# Altium schematic sheet Keypad.SchDoc: Keypad
size 406 x 304 mm; Author: JFOSTER; Engineer: JFOSTER; Revision: A; SheetNumber: 1; SheetTotal: 1; Designer: JFOSTER
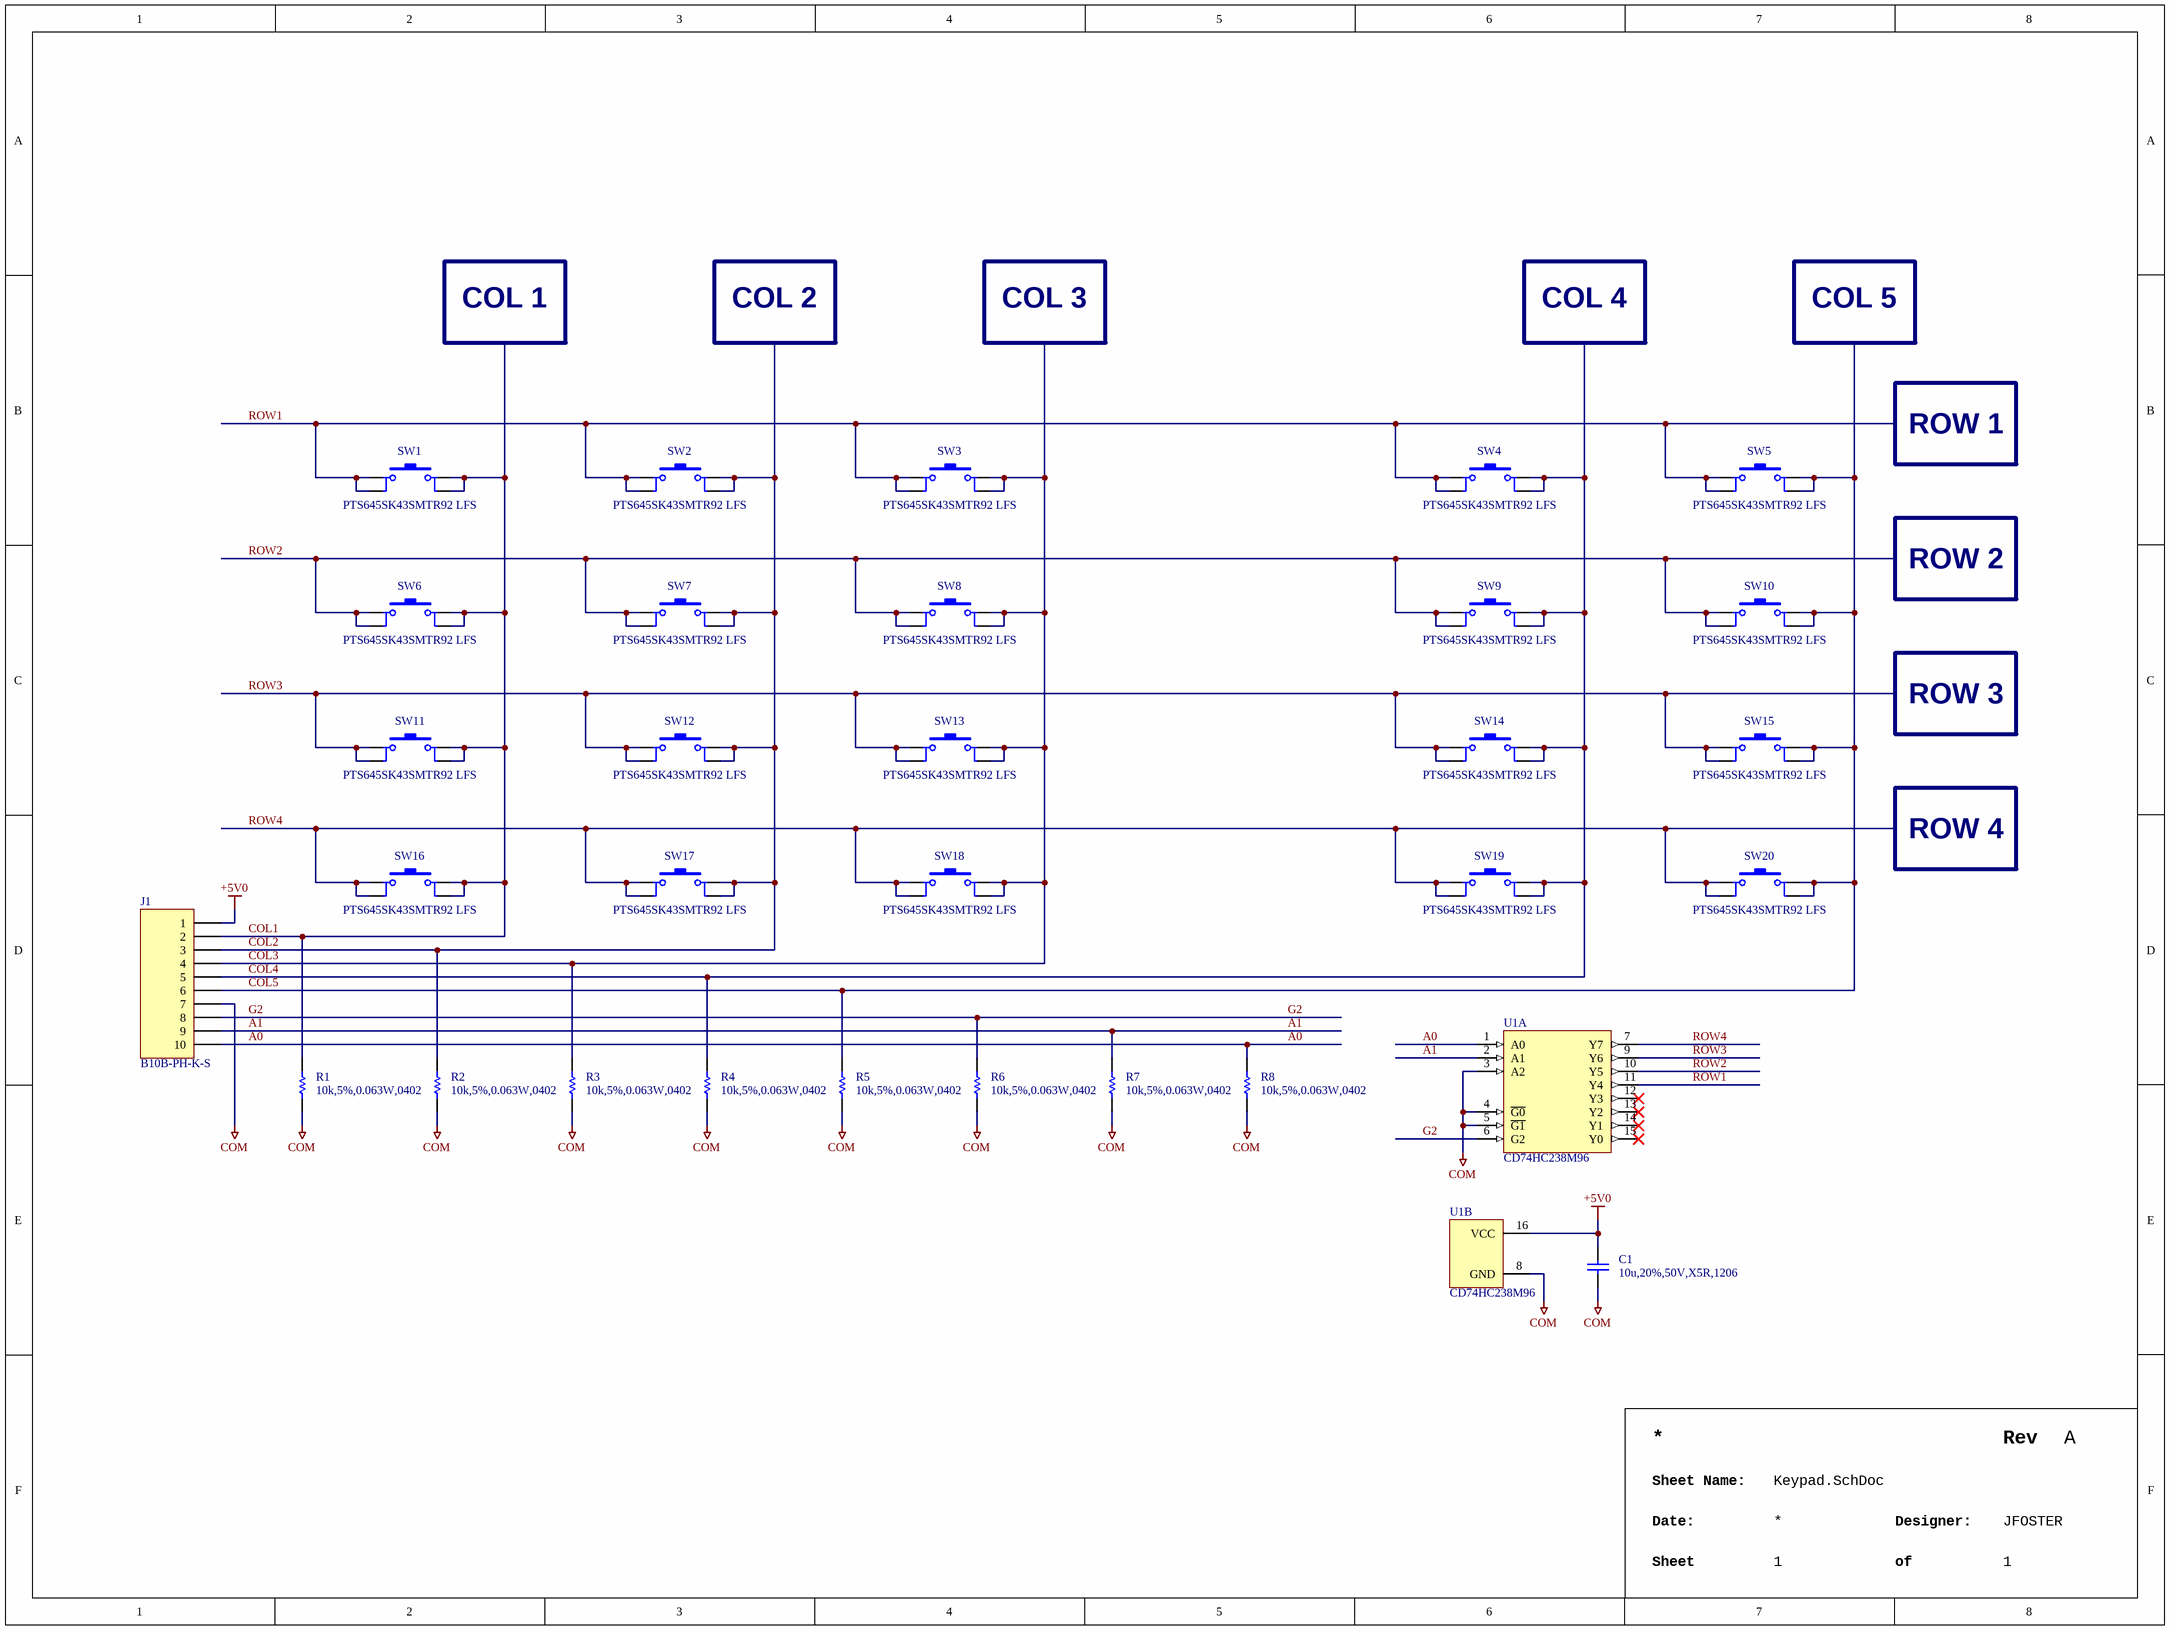
[diagram p0: Keypad.SchDoc]

## Parts
C1  10u,20%,50V,X5R,1206  [CAPC3216X16N]
J1  B10B-PH-K-S  [JST_B10B-PH-K-S]
R1  10k,5%,0.063W,0402  [RESC1005X04N]
R2  10k,5%,0.063W,0402  [RESC1005X04N]
R3  10k,5%,0.063W,0402  [RESC1005X04N]
R4  10k,5%,0.063W,0402  [RESC1005X04N]
R5  10k,5%,0.063W,0402  [RESC1005X04N]
R6  10k,5%,0.063W,0402  [RESC1005X04N]
R7  10k,5%,0.063W,0402  [RESC1005X04N]
R8  10k,5%,0.063W,0402  [RESC1005X04N]
SW1  PTS645SK43SMTR92 LFS  [C&K_PTS645SK43SMTR92 LFS]
SW2  PTS645SK43SMTR92 LFS  [C&K_PTS645SK43SMTR92 LFS]
SW3  PTS645SK43SMTR92 LFS  [C&K_PTS645SK43SMTR92 LFS]
SW4  PTS645SK43SMTR92 LFS  [C&K_PTS645SK43SMTR92 LFS]
SW5  PTS645SK43SMTR92 LFS  [C&K_PTS645SK43SMTR92 LFS]
SW6  PTS645SK43SMTR92 LFS  [C&K_PTS645SK43SMTR92 LFS]
SW7  PTS645SK43SMTR92 LFS  [C&K_PTS645SK43SMTR92 LFS]
SW8  PTS645SK43SMTR92 LFS  [C&K_PTS645SK43SMTR92 LFS]
SW9  PTS645SK43SMTR92 LFS  [C&K_PTS645SK43SMTR92 LFS]
SW10  PTS645SK43SMTR92 LFS  [C&K_PTS645SK43SMTR92 LFS]
SW11  PTS645SK43SMTR92 LFS  [C&K_PTS645SK43SMTR92 LFS]
SW12  PTS645SK43SMTR92 LFS  [C&K_PTS645SK43SMTR92 LFS]
SW13  PTS645SK43SMTR92 LFS  [C&K_PTS645SK43SMTR92 LFS]
SW14  PTS645SK43SMTR92 LFS  [C&K_PTS645SK43SMTR92 LFS]
SW15  PTS645SK43SMTR92 LFS  [C&K_PTS645SK43SMTR92 LFS]
SW16  PTS645SK43SMTR92 LFS  [C&K_PTS645SK43SMTR92 LFS]
SW17  PTS645SK43SMTR92 LFS  [C&K_PTS645SK43SMTR92 LFS]
SW18  PTS645SK43SMTR92 LFS  [C&K_PTS645SK43SMTR92 LFS]
SW19  PTS645SK43SMTR92 LFS  [C&K_PTS645SK43SMTR92 LFS]
SW20  PTS645SK43SMTR92 LFS  [C&K_PTS645SK43SMTR92 LFS]
U1  CD74HC238M96  [TEXASINSTRUMENTS_PKG_NS0016A]  (parts A,B of 2)

## Nets
+5V0: C1.2 J1.1 U1.16(VCC)
COM: C1.1 J1.7 R1.1 R2.1 R3.1 R4.1 R5.1 R6.1 R7.1 R8.1 U1.3(A2) U1.4(~{G0}) U1.5(~{G1}) U1.8(GND)
A0: J1.10 R8.2 U1.1(A0)
A1: J1.9 R7.2 U1.2(A1)
COL1: J1.2 R1.2 SW1.3 SW1.4 SW6.3 SW6.4 SW11.3 SW11.4 SW16.3 SW16.4
COL2: J1.3 R2.2 SW2.3 SW2.4 SW7.3 SW7.4 SW12.3 SW12.4 SW17.3 SW17.4
COL3: J1.4 R3.2 SW3.3 SW3.4 SW8.3 SW8.4 SW13.3 SW13.4 SW18.3 SW18.4
COL4: J1.5 R4.2 SW4.3 SW4.4 SW9.3 SW9.4 SW14.3 SW14.4 SW19.3 SW19.4
COL5: J1.6 R5.2 SW5.3 SW5.4 SW10.3 SW10.4 SW15.3 SW15.4 SW20.3 SW20.4
G2: J1.8 R6.2 U1.6(G2)
ROW1: SW1.1 SW1.2 SW2.1 SW2.2 SW3.1 SW3.2 SW4.1 SW4.2 SW5.1 SW5.2 U1.11(Y4)
ROW2: SW6.1 SW6.2 SW7.1 SW7.2 SW8.1 SW8.2 SW9.1 SW9.2 SW10.1 SW10.2 U1.10(Y5)
ROW3: SW11.1 SW11.2 SW12.1 SW12.2 SW13.1 SW13.2 SW14.1 SW14.2 SW15.1 SW15.2 U1.9(Y6)
ROW4: SW16.1 SW16.2 SW17.1 SW17.2 SW18.1 SW18.2 SW19.1 SW19.2 SW20.1 SW20.2 U1.7(Y7)

Not connected (* = marked no-connect by the designer): U1 12(Y3)* 13(Y2)* 14(Y1)* 15(Y0)*

## Notes on the sheet
- COL 1
- COL 2
- COL 3
- COL 4
- COL 5
- ROW 1
- ROW 2
- ROW 3
- ROW 4
- Rev
- Sheet Name:
- Date:
- Sheet
- Designer:
- of

## Library data of the parts
C1 = CAP,Cer,10uF,50VDC,X5R,1206: 10ï¿½F ï¿½20% 50V Ceramic Capacitor X5R 1206 (3216 Metric); Manufacturer 1: Samsung Electro-Mechanics; Manufacturer 1 Part Number: CL31A106MBHNNNE; Vendor 1 Part Number: 1276-6736-1-ND; Vendor 1: Digikey; Part Name: CAP,Cer,10uF,50VDC,X5R,1206; CreatedBy: Judd Foster; HelpURL: https://www.samsungsem.com/resources/file/global/support/product_catalog/MLCC.pdf; Value: 10u
J1 = CONN,JST,10 Pin,2mm,Vert,Thru: Connector Header Through Hole 10 position 0.079" (2.00mm); Manufacturer 1: JST Sales America Inc.; Vendor 1 Part Number: 455-1712-ND; Vendor 1: DigiKey; Part Name: CONN,JST,10 Pin,2mm,Vert,Thru; CreatedBy: Judd Foster; HelpURL: https://www.jst-mfg.com/product/pdf/eng/ePH.pdf; Manufacturer 1 Part Number: B10B-PH-K-S
R1-R8 = RES,10k,5%,0.063W,0402: 10 kOhms ï¿½5% 0.063W, 1/16W Chip Resistor 0402 (1005 Metric) Automotive AEC-Q200 Thick Film; Manufacturer 1: Stackpole Electronics Inc; Manufacturer 1 Part Number: RMCF0402JT10K0; Vendor 1 Part Number: RMCF0402JT10K0CT-ND; Vendor 1: DIgikey; Part Name: RES,10k,5%,0.063W,0402; CreatedBy: Judd Foster; HelpURL: https://www.seielect.com/catalog/sei-rmcf_rmcp.pdf; Value: 10k
SW1-SW20 = Switch,Tactile,SPST-NO,SMD,H4.3: Tactile Switch SPST-NO Top Actuated Surface Mount; Manufacturer 1: C&K; Vendor 1 Part Number: CKN9084CT-ND; Vendor 1: Digikey; Part Name: Switch,Tactile,SPST-NO,SMD,H4.3; CreatedBy: Judd Foster; HelpURL: https://www.ckswitches.com/media/1471/pts645.pdf; Manufacturer 1 Part Number: PTS645SK43SMTR92 LFS
U1 = CD74HC238M96: Decoder/Demultiplexer 1 x 3:8 16-SOIC; Manufacturer 1: Texas Instruments; Vendor 1 Part Number: 296-24353-1-ND; Vendor 1: DigiKey; Part Name: CD74HC238M96; CreatedBy: Judd Foster; HelpURL: https://www.ti.com/lit/ds/symlink/cd74hc138.pdf?HQS=dis-dk-null-digikeymode-dsf-pf-null-wwe&ts=1751370584044&ref_url=https%253A%252F%252Fwww.ti.com%252Fgeneral%252Fdocs%252Fsuppproductinfo.tsp%253FdistId%253D10%2526gotoUrl%253Dhttps%253A%252F%252Fwww.ti.c; Manufacturer 1 Part Number: CD74HC238M96